# Altium schematic sheet 01-Breadboard.SchDoc
size A4; DocumentNumber: 4; SheetNumber: 1; SheetTotal: 26
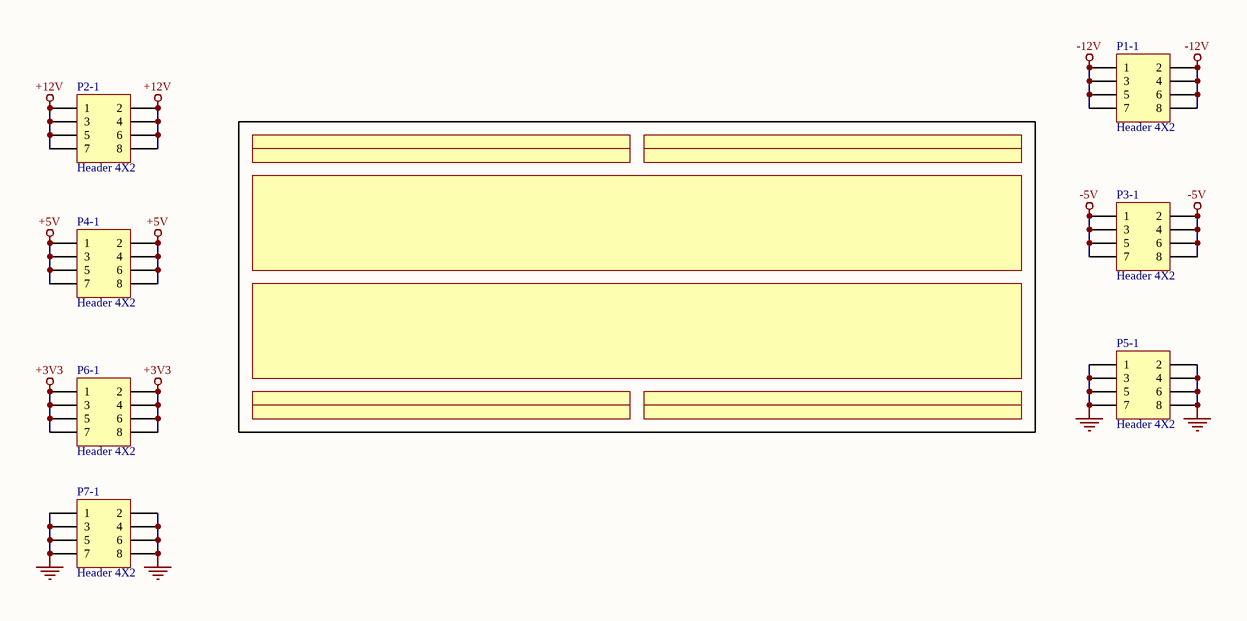
[diagram p0: 01-Breadboard.SchDoc]

## Parts
P1-1  Header 4X2  [JP2.54-F-2x04A]
P2-1  Header 4X2  [JP2.54-F-2x04A]
P3-1  Header 4X2  [JP2.54-F-2x04A]
P4-1  Header 4X2  [JP2.54-F-2x04A]
P5-1  Header 4X2  [JP2.54-F-2x04A]
P6-1  Header 4X2  [JP2.54-F-2x04A]
P7-1  Header 4X2  [JP2.54-F-2x04A]

## Nets
+3V3: P6-1.1 P6-1.2 P6-1.3 P6-1.4 P6-1.5 P6-1.6 P6-1.7 P6-1.8
+5V: P4-1.1 P4-1.2 P4-1.3 P4-1.4 P4-1.5 P4-1.6 P4-1.7 P4-1.8
+12V: P2-1.1 P2-1.2 P2-1.3 P2-1.4 P2-1.5 P2-1.6 P2-1.7 P2-1.8
-5V: P3-1.1 P3-1.2 P3-1.3 P3-1.4 P3-1.5 P3-1.6 P3-1.7 P3-1.8
-12V: P1-1.1 P1-1.2 P1-1.3 P1-1.4 P1-1.5 P1-1.6 P1-1.7 P1-1.8
GND: P5-1.1 P5-1.2 P5-1.3 P5-1.4 P5-1.5 P5-1.6 P5-1.7 P5-1.8 P7-1.1 P7-1.2 P7-1.3 P7-1.4 P7-1.5 P7-1.6 P7-1.7 P7-1.8

## Library data of the parts
P1-1 P2-1 P3-1 P4-1 P5-1 P6-1 P7-1 = Header 4X2: Header, 4-Pin, Dual row; LatestRevisionDate: 17-Jul-2002; LatestRevisionNote: Re-released for DXP Platform.; Publisher: Altium Limited